# EasyEDA schematic SCH_PLU-Piano-v1.1_2024-04-26.json

## Sheets
1 Sheet_1: TITLE: Player Piano Controller; REV: 1.0; Date: 2023-11-11; Sheet: 1/1; Drawn By: Eric Golde; Company: PLU Capstone
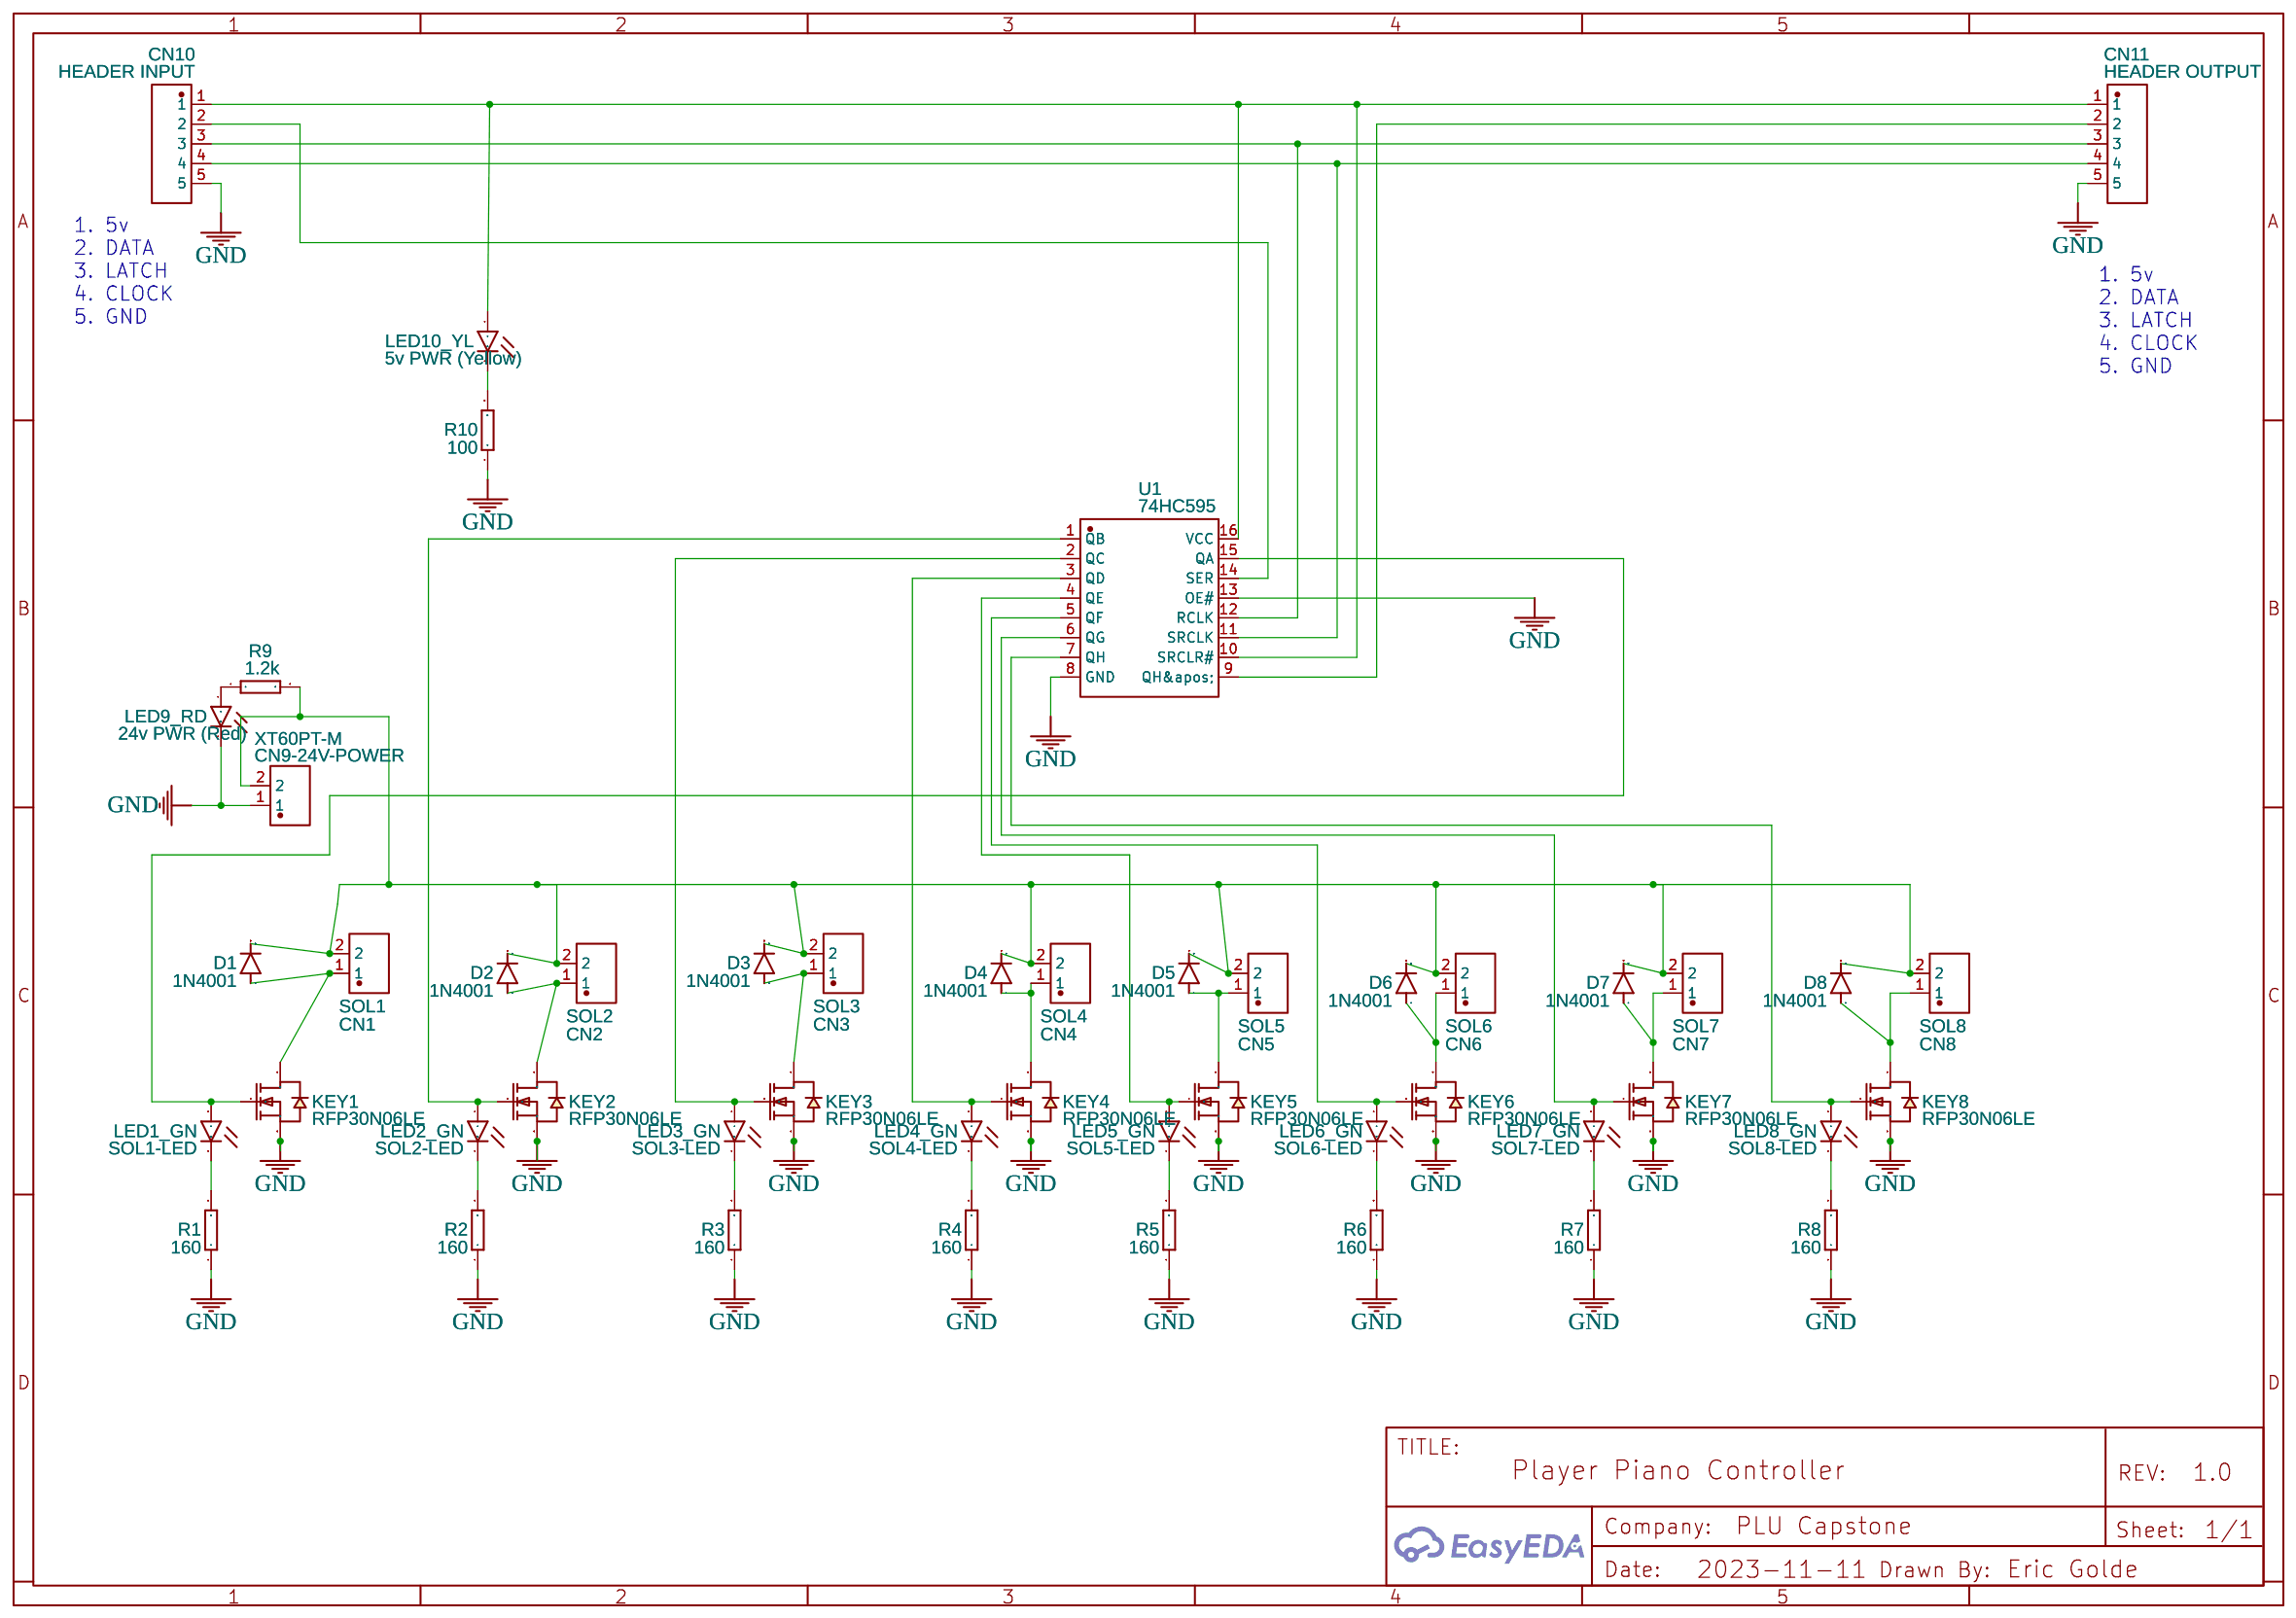
[diagram p0: Sheet_1]
2 SimplifiedForPowerpoint
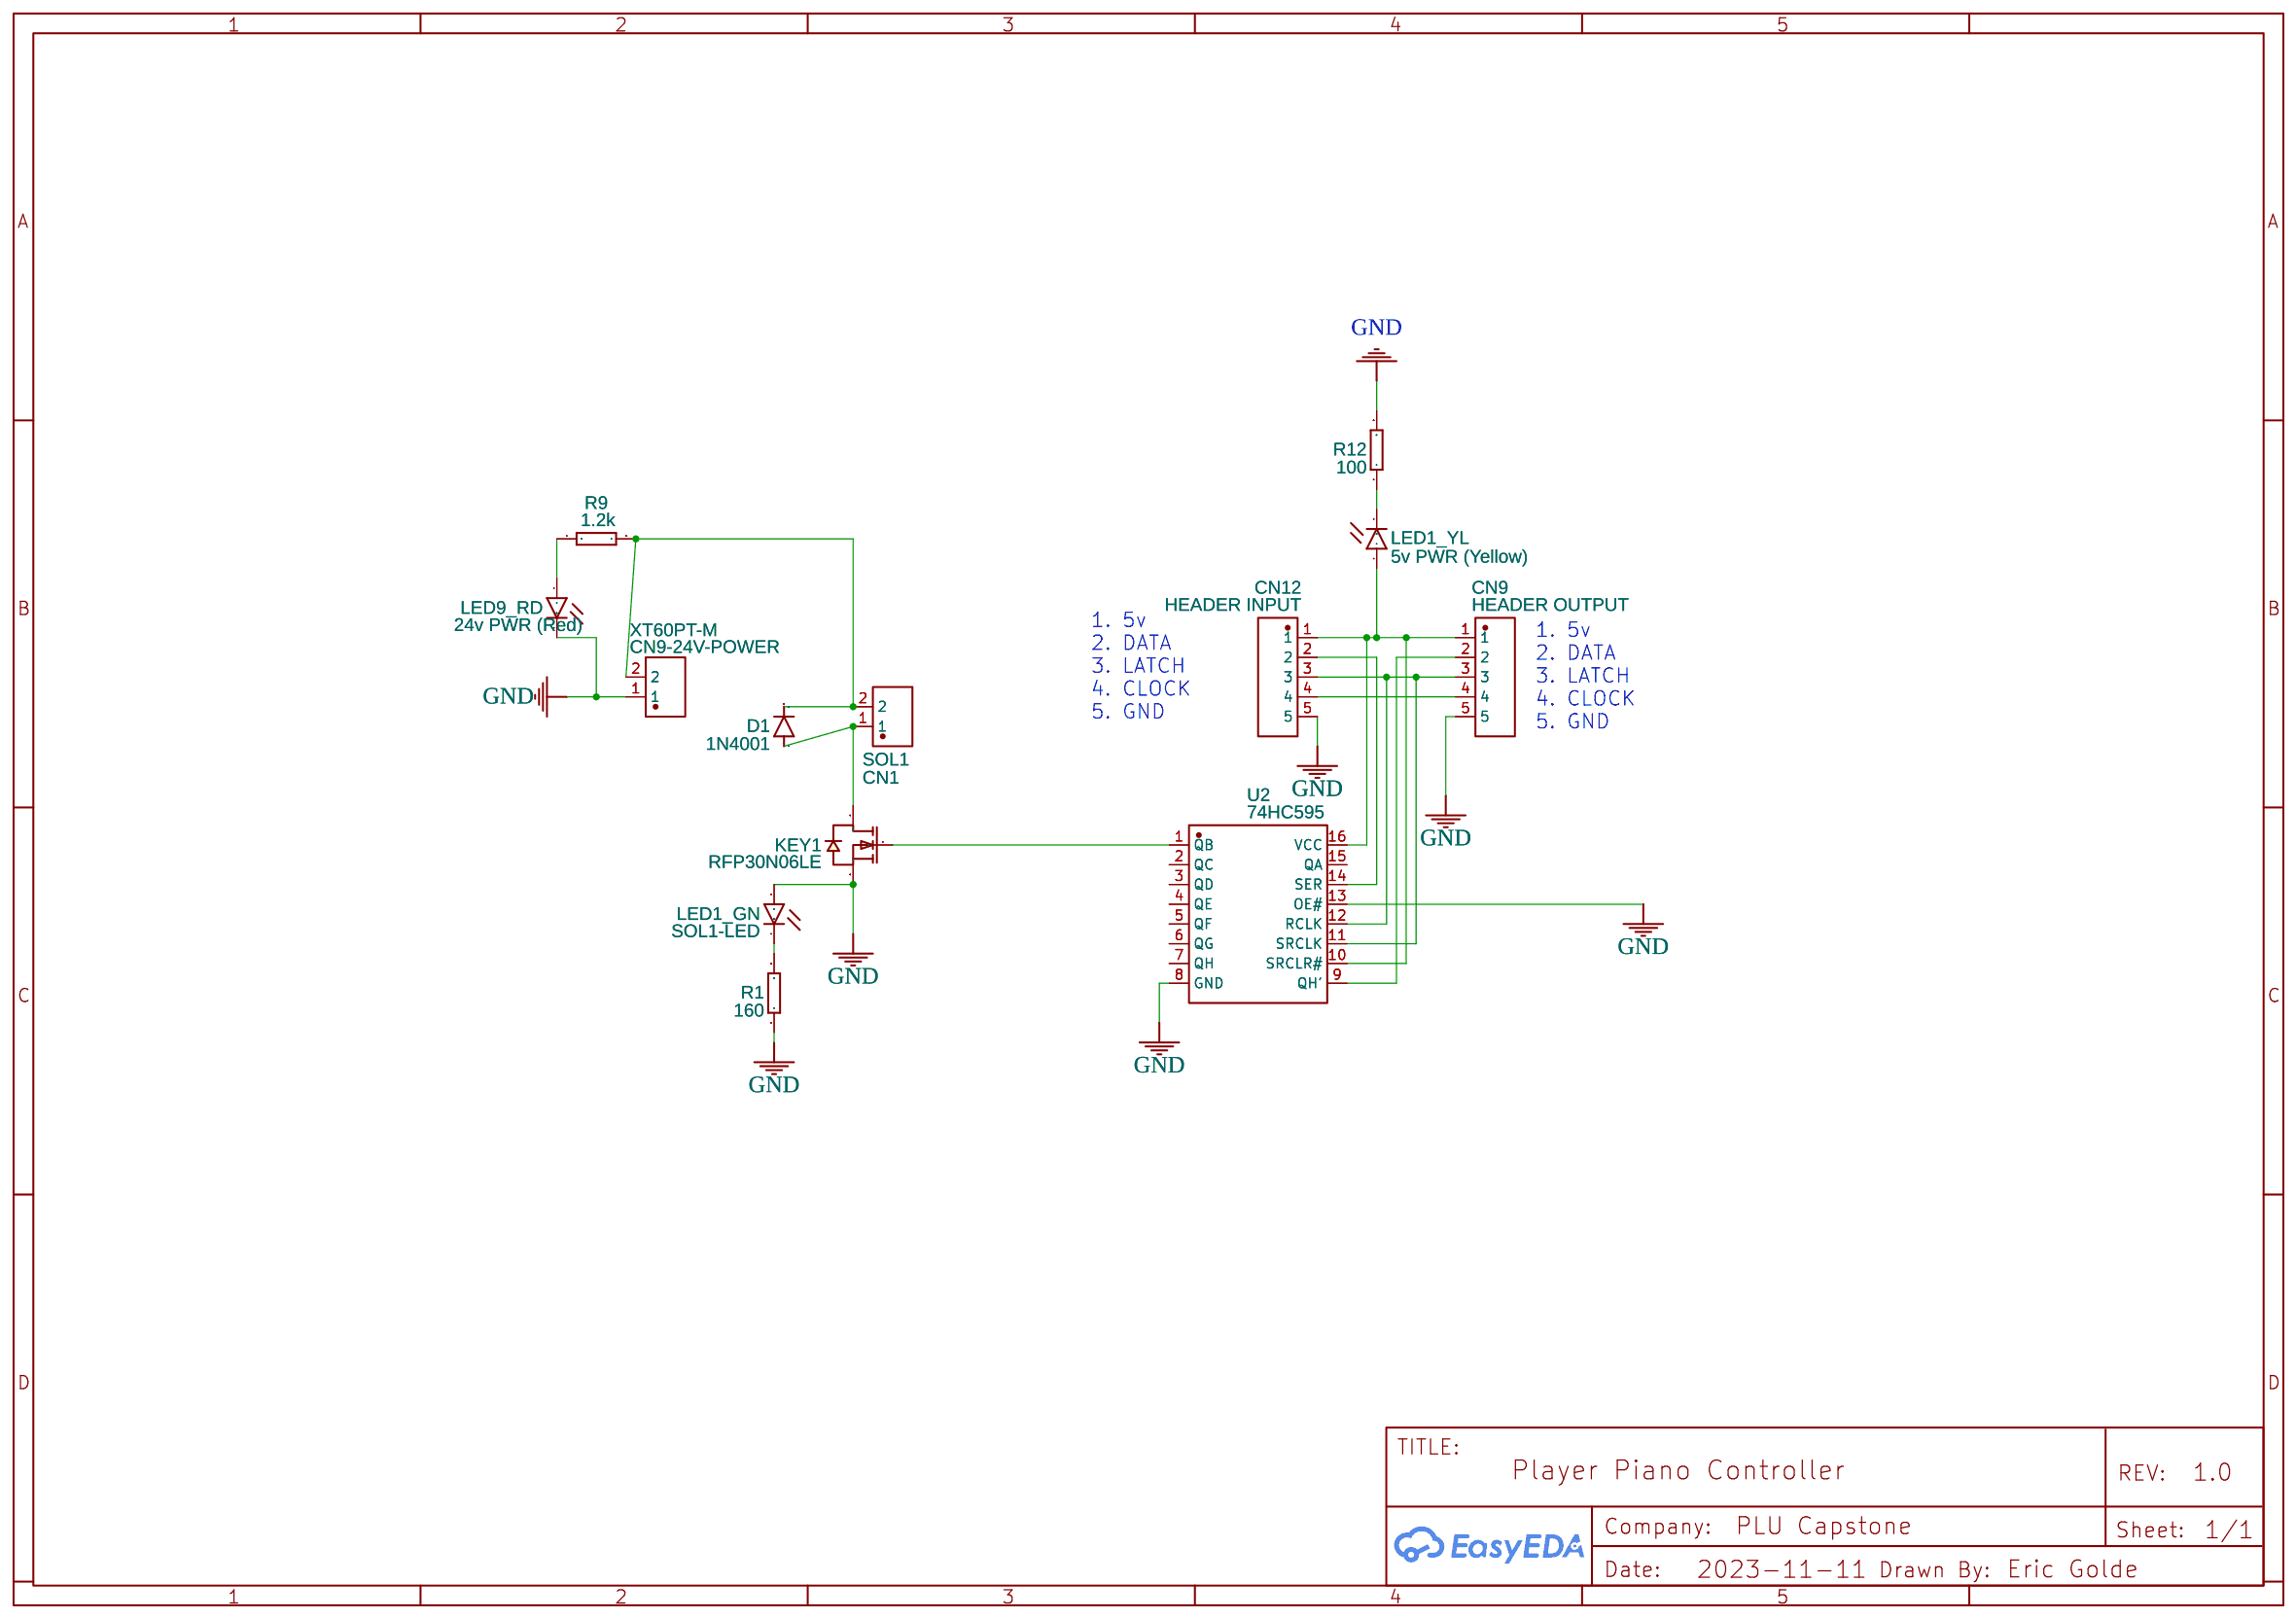
[diagram p1: SimplifiedForPowerpoint]

## Parts
sheet Sheet_1
CN1  SOL1  [CONN-TH_XH-2A]
CN2  SOL2  [CONN-TH_XH-2A]
CN3  SOL3  [CONN-TH_XH-2A]
CN4  SOL4  [CONN-TH_XH-2A]
CN5  SOL5  [CONN-TH_XH-2A]
CN6  SOL6  [CONN-TH_XH-2A]
CN7  SOL7  [CONN-TH_XH-2A]
CN8  SOL8  [CONN-TH_XH-2A]
CN9-24V-POWER  XT60PT-M  [CONN-TH_XT60]
CN10  HEADER INPUT  [CONN-TH_HEADER5]
CN11  HEADER OUTPUT  [CONN-TH_HEADER5]
D1  1N4001  [DIODE-1N4148]
D2  1N4001  [DIODE-1N4148]
D3  1N4001  [DIODE-1N4148]
D4  1N4001  [DIODE-1N4148]
D5  1N4001  [DIODE-1N4148]
D6  1N4001  [DIODE-1N4148]
D7  1N4001  [DIODE-1N4148]
D8  1N4001  [DIODE-1N4148]
KEY1  RFP30N06LE  [TO-220AB-3_L10.3-W4.5-P2.54-L-1]
KEY2  RFP30N06LE  [TO-220AB-3_L10.3-W4.5-P2.54-L-1]
KEY3  RFP30N06LE  [TO-220AB-3_L10.3-W4.5-P2.54-L-1]
KEY4  RFP30N06LE  [TO-220AB-3_L10.3-W4.5-P2.54-L-1]
KEY5  RFP30N06LE  [TO-220AB-3_L10.3-W4.5-P2.54-L-1]
KEY6  RFP30N06LE  [TO-220AB-3_L10.3-W4.5-P2.54-L-1]
KEY7  RFP30N06LE  [TO-220AB-3_L10.3-W4.5-P2.54-L-1]
KEY8  RFP30N06LE  [TO-220AB-3_L10.3-W4.5-P2.54-L-1]
LED1_GN  SOL1-LED  [LED5MM]
LED2_GN  SOL2-LED  [LED5MM]
LED3_GN  SOL3-LED  [LED5MM]
LED4_GN  SOL4-LED  [LED5MM]
LED5_GN  SOL5-LED  [LED5MM]
LED6_GN  SOL6-LED  [LED5MM]
LED7_GN  SOL7-LED  [LED5MM]
LED8_GN  SOL8-LED  [LED5MM]
LED9_RD  24v PWR (Red)  [LED5MM]
LED10_YL  5v PWR (Yellow)  [LED5MM]
R1  160  [RTH025W]
R2  160  [RTH025W]
R3  160  [RTH025W]
R4  160  [RTH025W]
R5  160  [RTH025W]
R6  160  [RTH025W]
R7  160  [RTH025W]
R8  160  [RTH025W]
R9  1.2k  [RTH025W]
R10  100  [RTH025W]
U1  74HC595  [PDIP-16_L19.7-W6.6-P2.54-LS7.6-BL]
sheet SimplifiedForPowerpoint
CN1#2  SOL1  [CONN-TH_XH-2A]
CN9  HEADER OUTPUT  [CONN-TH_HEADER5]
CN9-24V-POWER#2  XT60PT-M  [CONN-TH_XT60]
CN12  HEADER INPUT  [CONN-TH_HEADER5]
D1#2  1N4001  [DIODE-1N4148]
KEY1#2  RFP30N06LE  [TO-220AB-3_L10.3-W4.5-P2.54-L-1]
LED1_GN#2  SOL1-LED  [LED5MM]
LED1_YL  5v PWR (Yellow)  [LED5MM]
LED9_RD#2  24v PWR (Red)  [LED5MM]
R1#2  160  [RTH025W]
R9#2  1.2k  [RTH025W]
R12  100  [RTH025W]
U2  74HC595  [PDIP-16_L19.7-W6.6-P2.54-LS7.6-BL]

## Library data of the parts
CN1 CN1#2 CN2-CN8 = XH-2A_C2910525: Contributor: LCSC; Supplier: LCSC; Supplier Part: C2910525; Manufacturer: 韩国韩荣; Manufacturer Part: XH-2A; JLCPCB Part Class: Extended Part
CN9-24V-POWER CN9-24V-POWER#2 = XT60PT-M: Contributor: lcsc; Supplier: LCSC; Supplier Part: C98733; Manufacturer: AMASS(艾迈斯); link: https://lcsc.com/eda_search?q=C5155958&%26type=1&ref=editor
CN9-CN12 = HEADER5: Contributor: LCSC; Supplier: LCSC; Supplier Part: C9900003337; Manufacturer: null; Manufacturer Part: Header5; JLCPCB Part Class: Extended Part; link: https://lcsc.com/eda_search?q=C9900003337&%26type=1&ref=editor
D1 D1#2 = DIODE1N4148: Diode; Contributor: SparkFun; 3D Model: LED-TH-5MM_G COPY
D2-D8 = DIODE1N4148: Diode; Contributor: SparkFun
KEY1 KEY1#2 KEY2-KEY8 = RFP30N06LE: Contributor: LCSC; Supplier: LCSC; Supplier Part: C878812; Manufacturer: VBsemi(微碧); Manufacturer Part: RFP30N06LE-VB; JLCPCB Part Class: Extended Part; link: https://lcsc.com/eda_search?q=C878812&%26type=1&ref=editor
LED1_GN LED1_GN#2 LED1_YL LED2_GN LED3_GN LED4_GN LED5_GN LED6_GN LED7_GN LED8_GN LED9_RD LED9_RD#2 LED10_YL = LED-IR-THRUTSAL6100: Contributor: SparkFun
R1 R1#2 R2-R8 R10 R12 = RESISTOR: Contributor: DangerousPrototype
R9 R9#2 = RESISTOR: Contributor: DangerousPrototype; Supplier: Mouser
U1 U2 = SN74HC595NE4: Contributor: lcsc; Supplier: LCSC; Supplier Part: C3303991; Manufacturer: TI(德州仪器); link: https://lcsc.com/eda_search?q=C3303991&%26type=1&ref=editor

## Nets
GND: CN9.5 CN9-24V-POWER.1 CN9-24V-POWER#2.1 CN10.5 CN11.5 CN12.5 KEY1.3(S) KEY1#2.3(S) KEY2.3(S) KEY3.3(S) KEY4.3(S) KEY5.3(S) KEY6.3(S) KEY7.3(S) KEY8.3(S) LED1_GN#2.A LED9_RD.K(C) LED9_RD#2.K(C) R1.1 R1#2.1 R2.1 R3.1 R4.1 R5.1 R6.1 R7.1 R8.1 R10.1 R12.2 U1.8(GND) U1.13(OE#) U2.8(GND) U2.13(OE#)
Net-(CN1#2-1): CN1#2.1 D1#2.A KEY1#2.2(D)
Net-(CN1#2-2): CN1#2.2 CN9-24V-POWER#2.2 D1#2.C R9#2.2
Net-(CN1-1): CN1.1 D1.A KEY1.2(D)
Net-(CN1-2): CN1.2 CN2.2 CN3.2 CN4.2 CN5.2 CN6.2 CN7.2 CN8.2 CN9-24V-POWER.2 D1.C D2.C D3.C D4.C D5.C D6.C D7.C D8.C R9.2
Net-(CN2-1): CN2.1 D2.A KEY2.2(D)
Net-(CN3-1): CN3.1 D3.A KEY3.2(D)
Net-(CN4-1): CN4.1 D4.A KEY4.2(D)
Net-(CN5-1): CN5.1 D5.A KEY5.2(D)
Net-(CN6-1): CN6.1 D6.A KEY6.2(D)
Net-(CN7-1): CN7.1 D7.A KEY7.2(D)
Net-(CN8-1): CN8.1 D8.A KEY8.2(D)
Net-(CN9-1): CN9.1 CN12.1 LED1_YL.A U2.10(SRCLR#) U2.16(VCC)
Net-(CN9-2): CN9.2 U2.9(QH')
Net-(CN9-3): CN9.3 CN12.3 U2.11(SRCLK) U2.12(RCLK)
Net-(CN9-4): CN9.4 CN12.4
Net-(CN10-1): CN10.1 CN11.1 LED10_YL.A U1.10(SRCLR#) U1.16(VCC)
Net-(CN10-2): CN10.2 U1.14(SER)
Net-(CN10-3): CN10.3 CN11.3 U1.12(RCLK)
Net-(CN10-4): CN10.4 CN11.4 U1.11(SRCLK)
Net-(CN11-2): CN11.2 U1.9(QH')
Net-(CN12-2): CN12.2 U2.14(SER)
Net-(KEY1#2-1): KEY1#2.1(G) U2.1(QB)
Net-(KEY1-1): KEY1.1(G) LED1_GN.A U1.15(QA)
Net-(KEY2-1): KEY2.1(G) LED2_GN.A U1.1(QB)
Net-(KEY3-1): KEY3.1(G) LED3_GN.A U1.2(QC)
Net-(KEY4-1): KEY4.1(G) LED4_GN.A U1.3(QD)
Net-(KEY5-1): KEY5.1(G) LED5_GN.A U1.4(QE)
Net-(KEY6-1): KEY6.1(G) LED6_GN.A U1.5(QF)
Net-(KEY7-1): KEY7.1(G) LED7_GN.A U1.6(QG)
Net-(KEY8-1): KEY8.1(G) LED8_GN.A U1.7(QH)
Net-(LED1_GN#2-K): LED1_GN#2.K(C) R1#2.2
Net-(LED1_GN-K): LED1_GN.K(C) R1.2
Net-(LED1_YL-K): LED1_YL.K(C) R12.1
Net-(LED2_GN-K): LED2_GN.K(C) R2.2
Net-(LED3_GN-K): LED3_GN.K(C) R3.2
Net-(LED4_GN-K): LED4_GN.K(C) R4.2
Net-(LED5_GN-K): LED5_GN.K(C) R5.2
Net-(LED6_GN-K): LED6_GN.K(C) R6.2
Net-(LED7_GN-K): LED7_GN.K(C) R7.2
Net-(LED8_GN-K): LED8_GN.K(C) R8.2
Net-(LED9_RD#2-A): LED9_RD#2.A R9#2.1
Net-(LED9_RD-A): LED9_RD.A R9.1
Net-(LED10_YL-K): LED10_YL.K(C) R10.2

Not connected (* = marked no-connect by the designer): U2 2(QC) 3(QD) 4(QE) 5(QF) 6(QG) 7(QH) 15(QA)

## Notes on the sheets
sheet 1
- 1. 5v
  2. DATA
  3. LATCH
  4. CLOCK
  5. GND
- 1. 5v
  2. DATA
  3. LATCH
  4. CLOCK
  5. GND
sheet 2
- 1. 5v
  2. DATA
  3. LATCH
  4. CLOCK
  5. GND
- 1. 5v
  2. DATA
  3. LATCH
  4. CLOCK
  5. GND
